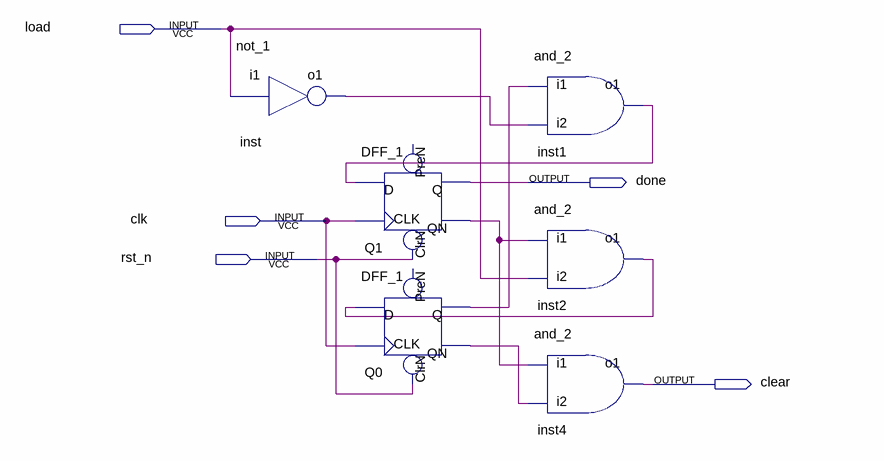
[diagram p0: schematic sheet]
// Quartus schematic Controller.bdf as structural Verilog: 6 symbols, 5 pins
module Controller (
  input  load,
  input  clk,
  input  rst_n,
  output done,
  output clear
);

  wire inst1_o1, inst2_o1, inst_o1, Q0_q, Q0_qn, Q1_qn;

  not_1 inst (.i1(load), .o1(inst_o1));
  DFF_1 Q1 (.CLK(clk), .D(inst1_o1), .ClrN(rst_n), .QN(Q1_qn), .Q(done));  // open: PreN
  DFF_1 Q0 (.CLK(clk), .D(inst2_o1), .ClrN(rst_n), .QN(Q0_qn), .Q(Q0_q));  // open: PreN
  and_2 inst1 (.i1(Q0_q), .i2(inst_o1), .o1(inst1_o1));
  and_2 inst2 (.i1(Q1_qn), .i2(load), .o1(inst2_o1));
  and_2 inst4 (.i1(Q1_qn), .i2(Q0_qn), .o1(clear));
endmodule
